# EAGLE design breakout_noxtal_4 (EAGLE 6.6.0)
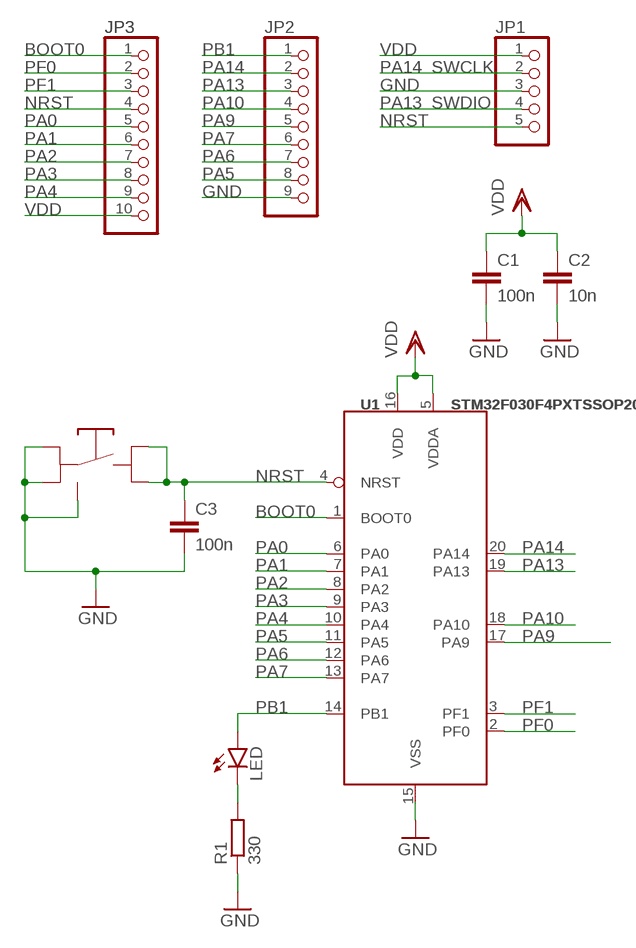
[diagram p0: schematic, sheet 1]

## Parts
C1  100n  C-EUC0603  [C0603]
C2  10n  C-EUC0603  [C0603]
C3  100n  C-EUC0603  [C0603]
JP1  PINHD-1X5/90  [1X05/90]
JP2  PINHD-1X9  [1X09]
JP3  PINHD-1X10  [1X10]
LED  LED  [LED-0603-CR]
R1  330  R-EUR0603  [R0603]
RESET  KMR2XXG  [KMR2XXG]
U1  STM32F030F4PXTSSOP20  [STM32F030F4PX_TSSOP20]

## Nets
BOOT0: JP3.1 U1.1(BOOT0)
GND: C1.2 C2.2 C3.2 JP1.3 JP2.9 R1.1 RESET.P$3 RESET.P$4 RESET.P$5(G) U1.15(VSS)
N$1: LED.1(C) R1.2
NRST: C3.1 JP1.5 JP3.4 RESET.P$1 RESET.P$2 U1.4(NRST)
PA0: JP3.5 U1.6(PA0)
PA1: JP3.6 U1.7(PA1)
PA2: JP3.7 U1.8(PA2)
PA3: JP3.8 U1.9(PA3)
PA4: JP3.9 U1.10(PA4)
PA5: JP2.8 U1.11(PA5)
PA6: JP2.7 U1.12(PA6)
PA7: JP2.6 U1.13(PA7)
PA9: JP2.5 U1.17(PA9)
PA10: JP2.4 U1.18(PA10)
PA13: JP1.4 JP2.3 U1.19(PA13)
PA14: JP1.2 JP2.2 U1.20(PA14)
PB1: JP2.1 LED.2(A) U1.14(PB1)
PF0: JP3.2 U1.2(PF0)
PF1: JP3.3 U1.3(PF1)
VDD: C1.1 C2.1 JP1.1 JP3.10 U1.5(VDDA) U1.16(VDD)

## Notes on the sheet
- SWCLK
- SWDIO

## Library data of the parts
C1-C3 = rcl_smd:C-EU
JP1 = pinhead:PINHD-1X5: PIN HEADER
JP2 = pinhead:PINHD-1X9: PIN HEADER
JP3 = pinhead:PINHD-1X10: PIN HEADER
LED = led:LED: LEDs Standard schematic elements and footprints for 5mm, 3mm, 1206, and 0603 sized LEDs. 5mm - Spark Fun Electronics SKU : COM-00529 (and others)
R1 = rcl_smd:R-EU
RESET = KMR2:KMR2XXG
U1 = STM32F030F4Px:STM32F030F4PX

## Board
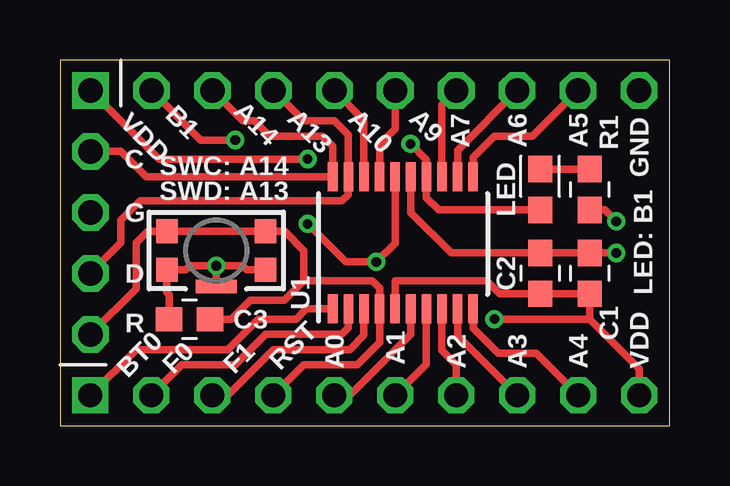
[diagram p1: board, top side]
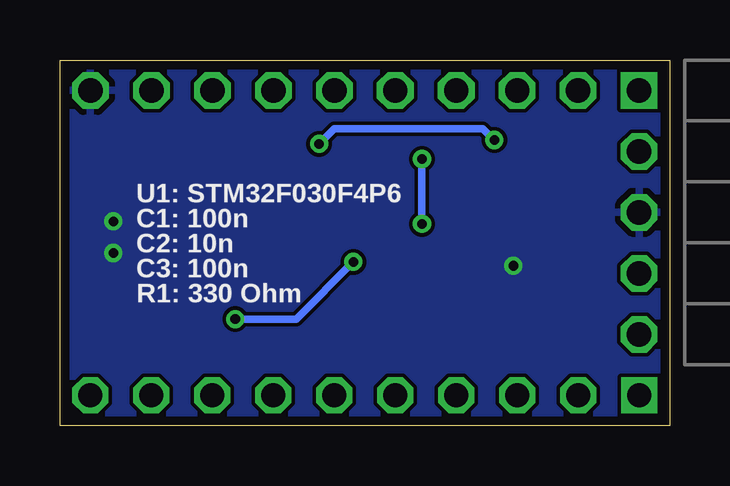
[diagram p2: board, bottom side, seen from below]

Size 25.4 x 15.24 mm. Coordinates in mm from the lower left corner, seen from the top.
Outline: 0,0 25.4,0 25.4,15.24 0,15.23 0,0
Copper layers (1*16): Top 0.0356mm / dielectric 1.5011mm / Bottom 0.0356mm
Design rules "LaenPCBOrder_OshPark *": minimum track width 6mil, minimum drill 13mil, track to track 6mil, track to pad 6mil, pad to pad 6mil, via to via 6mil, smd to smd 6mil, copper to edge 15mil, drill to drill 6mil, minimum pad ring 7mil, minimum via ring 7mil, stop-mask expansion 3mil, vias tented up to drill 0mil, thermal gap 10mil

### Footprints (pad centres in the part's own frame; a part is rotated, then mirrored left to right if it is on the bottom)
C0603 = smd 1.1 x 1: 1 -0.85,0; 2 0.85,0
1X05/90 = drill 1.016 square: 1 -5.08,-3.81 | drill 1.016 octagon: 2 -2.54,-3.81; 3 0,-3.81; 4 2.54,-3.81; 5 5.08,-3.81
1X09 = drill 1.016 octagon: 1 -10.16,0; 2 -7.62,0; 3 -5.08,0; 4 -2.54,0; 5 0,0; 6 2.54,0; 7 5.08,0; 8 7.62,0; 9 10.16,0
1X10 = drill 1 square: 1 -11.43,0 | drill 1 octagon: 2 -8.89,0; 3 -6.35,0; 4 -3.81,0; 5 -1.27,0; 6 1.27,0; 7 3.81,0; 8 6.35,0; 9 8.89,0; 10 11.43,0
LED-0603-CR = smd 1.1 x 1: 1 -0.85,0; 2 0.85,0
R0603 = smd 1.1 x 1: 1 -0.85,0; 2 0.85,0
KMR2XXG = smd 0.9 x 1: P$1 -2.05,-0.8; P$2 2.05,-0.8; P$3 2.05,0.8; P$4 -2.05,0.8 | smd 1.7 x 0.55: P$5 0,1.5
STM32F030F4PX_TSSOP20 = smd 0.4 x 1.2: 1 -2.925,-2.75; 2 -2.275,-2.75; 3 -1.625,-2.75; 4 -0.975,-2.75; 5 -0.325,-2.75; 6 0.325,-2.75; 7 0.975,-2.75; 8 1.625,-2.75; 9 2.275,-2.75; 10 2.925,-2.75; 11 2.925,2.75; 12 2.275,2.75; 13 1.625,2.75; 14 0.975,2.75; 15 0.325,2.75; 16 -0.325,2.75; 17 -0.975,2.75; 18 -1.625,2.75; 19 -2.275,2.75; 20 -2.925,2.75

### Placement (x,y rotation side)
C1  22.07,6.35 90 top
C2  20,6.35 90 top
C3  5.4,4.45 180 top
JP1  -2.54,8.89 270 bottom
JP2  13.97,13.97 0 top
JP3  12.7,1.27 0 top
LED  20,9.84 270 top
R1  22.07,9.84 90 top
RESET  6.51,7.3 180 top
U1  14.29,7.62 0 top

### Tracks (layer width: path | path; a pad name or v marks a point on that pad's centre or on a via)
BOOT0
  Top 0.305: JP3.1 3.17,3.17 6.99,3.17 8.26,4.45 9.84,4.45 10.27,4.87 U1.1
GND  (via drill 0.4)
  Top 0.305: U1.15 14.61,8.88 16.3,7.2 C2.2 C1.2 v23.18,7.2 | R1.1 22.7,8.99 v23.18,8.52 | v6.51,6.67 5.4,6.67 5.23,6.5 RESET.P$3 4.45,6.49 4.45,5.56 4.55,5.45 C3.2 | RESET.P$4 7.79,6.5 7.62,6.67 v6.51,6.67 | RESET.P$5 v6.51,6.67
  pour Bottom: 0,0 25.4,0 25.4,15.24 0,15.24
N$1
  Top 0.305: LED.1 R1.2
NRST
  Top 0.305: JP3.4 10.16,2.54 12.38,2.54 13.31,3.47 U1.4 13.31,5.74 13.02,6.03 10.16,6.03 | JP1.5 3.17,5.71 3.17,7.62 3.66,8.1 RESET.P$2 RESET.P$1 9.36,8.1 10.16,7.3 10.16,6.03 | C3.1 7.14,4.45 7.92,5.22 9.35,5.22 10.16,6.03
PA0
  Top 0.305: U1.6 14.61,3.82 12.06,1.27 JP3.5
PA1
  Top 0.305: U1.7 15.26,2.56 JP3.6
PA2
  Top 0.305: U1.8 15.91,3.14 16.51,2.54 JP3.7
PA3
  Top 0.305: U1.9 16.56,3.76 JP3.8
PA4
  Top 0.305: U1.10 17.21,4.06 18.26,3.02 19.84,3.02 JP3.9
PA5
  Top 0.305: U1.11 17.21,11.18 18.1,12.06 19.68,12.06 JP2.8
PA6
  Top 0.305: U1.12 16.56,11.48 JP2.7
PA7
  Top 0.305: U1.13 15.91,13.37 JP2.6
PA9
  Top 0.305: U1.17 13.31,11.72 13.97,12.38 JP2.5
PA10
  Top 0.305: U1.18 12.66,12.74 JP2.4
PA13
  Top 0.305: JP2.3 10.16,12.7 11.43,12.7 12.01,12.12 U1.19 12.01,9.63 11.75,9.37 3.33,9.37 2.54,8.57 2.54,7.62 JP1.4
PA14
  Top 0.305: JP2.2 7.62,12.7 8.1,12.7 8.73,12.06 10.95,12.06 11.36,11.66 U1.20 3.6,10.37 2.54,11.43 JP1.2
PB1  (via drill 0.4)
  Top 0.305: LED.2 15.77,8.99 15.26,9.5 U1.14 15.26,11.09 v14.61,11.75 | JP2.1 5.87,11.91 v7.3,11.91
  Bottom 0.305: v7.3,11.91 7.78,12.38 13.97,12.38 v14.61,11.75
PF0
  Top 0.305: U1.2 12.01,4.08 11.75,3.81 8.57,3.81 7.3,2.54 5.08,2.54 JP3.2
PF1
  Top 0.305: U1.3 12.66,3.77 12.06,3.17 8.89,3.17 6.99,1.27 JP3.3
VDD  (via drill 0.4)
  Top 0.305: U1.5 13.96,6.03 17.78,6.03 18.31,5.5 C2.1 C1.1 22.07,4.45 | v10.32,8.41 11.91,6.83 v13.18,6.83 13.96,7.61 U1.16 | 22.07,4.45 v18.1,4.45 | JP3.10 24.13,2.38 22.07,4.45 | JP1.1 4.13,11.11 v10.32,11.11
  Bottom 0.305: v10.32,11.11 v10.32,8.41 | v18.1,4.45 15.56,4.45 v13.18,6.83

### Text on the board
tPlace: VDD | B1 | A14 | A13 | A10 | A9 | GND | A7 | A6 | A5 | C | SWC: / SWD: | A14 / A13 | G | B1 | LED: | D | R | RST | A1 | BT0 | F0 | F1 | A0 | A2 | A3 | A4 | VDD
bPlace: U1: STM32F030F4P6 / C1: 100n / C2: 10n / C3: 100n / R1: 330 Ohm